# Altium project high-speed-thermocouple-logger.PrjPcb (part 3 of 3)

## Sheet mcu.SchDoc: tclogger
size A4; Date: 2024-05-30; CheckedBy: Boris Botev; DrawnBy: Iliyan Antov; Organization: Medical Technologies CZ a.s.; Revision: 100; SheetNumber: 9; SheetTotal: 10; Version1: N/A; Version2: N/A; Version3: N/A; Change1description: N/A; Change2description: N/A; Change3description: N/A; Change1DrawnBy: N/A; Change2DrawnBy: N/A; Change3DrawnBy: N/A; Change1CheckedBy: N/A; Change2CheckedBy: N/A; Change3CheckedBy: N/A; PreviusVersion_Chng1: N/A; PreviusVersion_Chng2: N/A; PreviusVersion_Chng3: N/A; Variant1description: Standard assembly; Variant2description: N/A; Variant3description: N/A; Variant4description: N/A; PrimaryCard1: XXXxxxXXX; PrimaryCard2: N/A; PrimaryCard3: N/A; PrimaryCard4: N/A; SPICEModelCacheGIGEAIGC: <root> / <DocumentId>GIGEAIGC</DocumentId> / <CacheFrame Number="0"> / <Model Name="grm188r72a104ka35" Kind="CKT"> / <Text>*---------------------------------------------------------------------- / * SPICE Model generated by Murata Manufacturing Co., Ltd. / * Copyright(C) Murata Manufacturing Co., Ltd. / * Description :1608M(0603)/X7R/0.1uF/100V / * Murata P/N :GRM188R72A104KA35 / * Property : C = 0.1[uF] / *---------------------------------------------------------------------- / * Applicable Conditions: / *   Frequency Range = 100Hz-6GHz / *   Temperature = 25 degC / *   DC Bias Voltage = 0V / *   Small Signal Operation / *---------------------------------------------------------------------- / .SUBCKT GRM188R72A104KA35 port1 port2 / C1 port1 11 9.94e-8 / L2 11 12 1.68e-10 / R3 12 13 1.35e-2 / C4 13 14 1.39e-5 / R4 13 14 285 / C5 14 15 2.35e-5 / R5 14 15 28.5 / C6 15 16 1.88e-5 / R6 15 16 7.00 / C7 16 17 1.68e-5 / R7 16 17 9.47e-1 / C8 17 18 1.50e-5 / R8 17 18 1.51e-1 / C9 18 19 1.07e-5 / R9 18 19 2.98e-2 / C10 19 20 1.31e-5 / R10 19 20 3.83e-3 / L11 20 21 1.43e-11 / R11 20 21 8.15e-2 / L12 21 22 1.08e-10 / R12 21 22 7.26e-2 / C13 22 23 4.76e-7 / L13 22 23 2.94e-11 / R13 22 23 3.05e-2 / C14 23 24 1.58e-7 / L14 23 24 2.63e-11 / R14 23 24 2.63e-2 / C15 24 port2 3.33e-12 / L15 24 port2 1.14e-10 / R15 24 port2 22.5 / R100 port1 11 5.00e+9 / .ENDS GRM188R72A104KA35</Text> / </Model> / <Model Name="c1608x5r1e475m080ac_p" Kind="CKT"> / <Text>*---------------------------------------------------------------------- / * SPICE Netlist Generated by TDK Corporation / * Copyright(C) 2015 TDK Corporation. / * All Rights Reserved. / *---------------------------------------------------------------------- / * TDK P/N: C1608X5R1E475M080AC (Multilayer Ceramic Chip Capacitor) / * Property: C=4.7uF / * Size(LxWxT): 1.6x0.8x0.8mm, 0.063x0.031x0.031inches / * Model Type: Precise Model / * Model Generated on June 29, 2015 / *---------------------------------------------------------------------- / * Terms and conditions regarding TDK Simulation Models: / * 1)This simulation model is being provided solely for informational / *   purposes. Please refer to the specifications of the products in / *   terms of detailed characteristics of such products. / * 2)In no event shall TDK Corporation of any of its subsidiaries be / *   liable for any loss or damage arising, directly or indirectly, / *   from any information contained in this simulation model, including, / *   but not limited to loss or damages arising from any inaccuracies, / *   omissions or errors in connection with such information. / * 3)Any and all copyrights on this simulation model are owned by / *   TDK Corporation.  Duplication or redistribution of this simulation / *   model without prior written permission from TDK Corporation / *   is prohibited. / * 4)This simulation model is subject to any modification or change / *   without any prior notice. / * 5)Neither TDK Corporation nor any of its subsidiaries shall make any / *   warranty, express or implied, including but not limited to the / *   correctness, implied warranties of merchantability and fitness for / *   a particular purpose with respect to this simulation models. / * 6)The use of this simulation model shall be deemed to have consented / *   to the terms and conditions hereof. / *---------------------------------------------------------------------- / * External Node Assignments: / * / *  n1 ---| |--- n2 / * / *---------------------------------------------------------------------- / * Applicable Conditions: / *   Temperature = 25 degC / *   DC Bias Voltage = 0 V / *   Small Signal Operation / *---------------------------------------------------------------------- / .SUBCKT C1608X5R1E475M080AC_p n1 n2 / C1 n1 11 4.06623047E-06 / C2 n1 12 1.69290768E-07 / C3 n1 13 1.69290768E-07 / C4 n1 14 1.69290768E-07 / C5 n1 15 1.69290768E-07 / C6 n1 16 1.69290768E-07 / C7 n1 17 1.69290768E-07 / L1 n2 21 4.20000000E-10 / R1 11 21 3.80511499E-03 / R2 11 12 2.03392838E+00 / R3 11 13 1.38719873E+01 / R4 11 14 9.43354501E+01 / R5 11 15 6.39787773E+02 / R6 11 16 4.32816378E+03 / R7 11 17 2.92113653E+04 / R8 n1 11 2.10000000E+07 / .ENDS C1608X5R1E475M080AC_p</Text> / </Model> / <Model Name="mmz2012y152bt000_s" Kind="CKT"> / <Text>*---------------------------------------------------------------------- / * SPICE Netlist Generated by TDK Corporation / * Copyright(C) 2015 TDK Corporation. / * All Rights Reserved. / *---------------------------------------------------------------------- / * TDK P/N: MMZ2012Y152BT000 (Chip Bead) / * Property: |Z|=1500ohm at 100MHz / * Size(LxWxT): 2x1.25x0.85mm, 0.079x0.049x0.033inches / * Model Type: Simple Model / * Model Generated on June 29, 2015 / *---------------------------------------------------------------------- / * Terms and conditions regarding TDK Simulation Models: / * 1)This simulation model is being provided solely for informational / *   purposes. Please refer to the specifications of the products in / *   terms of detailed characteristics of such products. / * 2)In no event shall TDK Corporation of any of its subsidiaries be / *   liable for any loss or damage arising, directly or indirectly, / *   from any information contained in this simulation model, including, / *   but not limited to loss or damages arising from any inaccuracies, / *   omissions or errors in connection with such information. / * 3)Any and all copyrights on this simulation model are owned by / *   TDK Corporation.  Duplication or redistribution of this simulation / *   model without prior written permission from TDK Corporation / *   is prohibited. / * 4)This simulation model is subject to any modification or change / *   without any prior notice. / * 5)Neither TDK Corporation nor any of its subsidiaries shall make any / *   warranty, express or implied, including but not limited to the / *   correctness, implied warranties of merchantability and fitness for / *   a particular purpose with respect to this simulation models. / * 6)The use of this simulation model shall be deemed to have consented / *   to the terms and conditions hereof. / *---------------------------------------------------------------------- / * External Node Assignments: / * / *  n1 ---@@@--- n2 / * / *---------------------------------------------------------------------- / * Applicable Conditions: / *   Temperature = 25 degC / *   DC Bias Current = 0 A / *   Small Signal Operation / *---------------------------------------------------------------------- / .SUBCKT MMZ2012Y152BT000_s n1 n2 / C1 n1 11 6.60000000E-13 / L1 n1 11 2.70000000E-06 / R1 n1 11 1.60000000E+03 / R2 n2 11 2.50000000E-01 / .ENDS MMZ2012Y152BT000_s</Text> / </Model> / <Model Name="mmz1608b301ctah0_s" Kind="CKT"> / <Text>*---------------------------------------------------------------------- / * SPICE Netlist Generated by TDK Corporation / * Copyright(C) 2015 TDK Corporation. / * All Rights Reserved. / *---------------------------------------------------------------------- / * TDK P/N: MMZ1608B301CTAH0 (Chip Bead) / * Property: |Z|=300ohm at 100MHz / * Size(LxWxT): 1.6x0.8x0.6mm, 0.063x0.031x0.024inches / * Model Type: Simple Model / * Model Generated on June 29, 2015 / *---------------------------------------------------------------------- / * Terms and conditions regarding TDK Simulation Models: / * 1)This simulation model is being provided solely for informational / *   purposes. Please refer to the specifications of the products in / *   terms of detailed characteristics of such products. / * 2)In no event shall TDK Corporation of any of its subsidiaries be / *   liable for any loss or damage arising, directly or indirectly, / *   from any information contained in this simulation model, including, / *   but not limited to loss or damages arising from any inaccuracies, / *   omissions or errors in connection with such information. / * 3)Any and all copyrights on this simulation model are owned by / *   TDK Corporation.  Duplication or redistribution of this simulation / *   model without prior written permission from TDK Corporation / *   is prohibited. / * 4)This simulation model is subject to any modification or change / *   without any prior notice. / * 5)Neither TDK Corporation nor any of its subsidiaries shall make any / *   warranty, express or implied, including but not limited to the / *   correctness, implied warranties of merchantability and fitness for / *   a particular purpose with respect to this simulation models. / * 6)The use of this simulation model shall be deemed to have consented / *   to the terms and conditions hereof. / *---------------------------------------------------------------------- / * External Node Assignments: / * / *  n1 ---@@@--- n2 / * / *---------------------------------------------------------------------- / * Applicable Conditions: / *   Temperature = 25 degC / *   DC Bias Current = 0 A / *   Small Signal Operation / *---------------------------------------------------------------------- / .SUBCKT MMZ1608B301CTAH0_s n1 n2 / C1 n1 11 3.00000000E-13 / L1 n1 11 5.30000000E-06 / R1 n1 11 3.00000000E+02 / R2 n2 11 1.50000000E-01 / .ENDS MMZ1608B301CTAH0_s</Text> / </Model> / <Model Name="grt188r61h105ke13" Kind="CKT"> / <Text>*---------------------------------------------------------------------- / * SPICE Model generated by Murata Manufacturing Co., Ltd. / * Copyright(C) Murata Manufacturing Co., Ltd. / * Description :1608M(0603)/X5R/1uF/50V / * Murata P/N :GRT188R61H105KE13 / * Property : C = 1[uF] / *---------------------------------------------------------------------- / * Applicable Conditions: / *   Frequency Range = 100Hz-6GHz / *   Temperature = 25 degC / *   DC Bias Voltage = 5V / *   Small Signal Operation / *---------------------------------------------------------------------- / .SUBCKT GRT188R61H105KE13 port1 port2 / C1 port1 11 7.62e-7 / L2 11 12 1.16e-10 / R3 12 13 7.65e-3 / C4 13 14 3.94e-6 / R4 13 14 1.77e+3 / C5 14 15 1.75e-5 / R5 14 15 15.4 / C6 15 16 1.51e-5 / R6 15 16 1.76 / C7 16 17 1.17e-5 / R7 16 17 2.01e-1 / C8 17 18 8.13e-6 / R8 17 18 2.61e-2 / L9 18 19 2.29e-11 / R9 18 19 8.12e-2 / L10 19 20 1.53e-10 / R10 19 20 4.15e-2 / C11 20 21 2.62e-6 / L11 20 21 3.15e-11 / R11 20 21 1.12e-2 / C12 21 22 7.84e-7 / L12 21 22 5.54e-11 / R12 21 22 1.32e-2 / C13 22 port2 1.55e-12 / L13 22 port2 1.73e-10 / R13 22 port2 64.4 / R100 port1 11 5.00e+7 / .ENDS GRT188R61H105KE13</Text> / </Model> / <Model Name="c1608c0g1h103j080aa_p" Kind="CKT"> / <Text>*---------------------------------------------------------------------- / * SPICE Netlist Generated by TDK Corporation / * Copyright(C) 2015 TDK Corporation. / * All Rights Reserved. / *---------------------------------------------------------------------- / * TDK P/N: C1608C0G1H103J080AA (Multilayer Ceramic Chip Capacitor) / * Property: C=10nF / * Size(LxWxT): 1.6x0.8x0.8mm, 0.063x0.031x0.031inches / * Model Type: Precise Model / * Model Generated on June 29, 2015 / *---------------------------------------------------------------------- / * Terms and conditions regarding TDK Simulation Models: / * 1)This simulation model is being provided solely for informational / *   purposes. Please refer to the specifications of the products in / *   terms of detailed characteristics of such products. / * 2)In no event shall TDK Corporation of any of its subsidiaries be / *   liable for any loss or damage arising, directly or indirectly, / *   from any information contained in this simulation model, including, / *   but not limited to loss or damages arising from any inaccuracies, / *   omissions or errors in connection with such information. / * 3)Any and all copyrights on this simulation model are owned by / *   TDK Corporation.  Duplication or redistribution of this simulation / *   model without prior written permission from TDK Corporation / *   is prohibited. / * 4)This simulation model is subject to any modification or change / *   without any prior notice. / * 5)Neither TDK Corporation nor any of its subsidiaries shall make any / *   warranty, express or implied, including but not limited to the / *   correctness, implied warranties of merchantability and fitness for / *   a particular purpose with respect to this simulation models. / * 6)The use of this simulation model shall be deemed to have consented / *   to the terms and conditions hereof. / *---------------------------------------------------------------------- / * External Node Assignments: / * / *  n1 ---| |--- n2 / * / *---------------------------------------------------------------------- / * Applicable Conditions: / *   Temperature = 25 degC / *   DC Bias Voltage = 0 V / *   Small Signal Operation / *---------------------------------------------------------------------- / .SUBCKT C1608C0G1H103J080AA_p n1 n2 / C1 n1 11 1.00000000E-08 / L1 11 12 3.87447524E-10 / L2 12 13 3.02537762E-11 / L3 13 14 6.87230213E-11 / L4 14 15 1.66916342E-10 / L5 15 16 4.94708926E-10 / R1 n2 12 7.79169483E-02 / R2 n2 13 3.60336449E-02 / R3 n2 14 1.66641994E-02 / R4 n2 15 7.70656268E-03 / R5 n2 16 3.56399409E-03 / R6 n1 11 1.00000000E+10 / .ENDS C1608C0G1H103J080AA_p</Text> / </Model> / </CacheFrame> / </root>; DocumentName: Docname
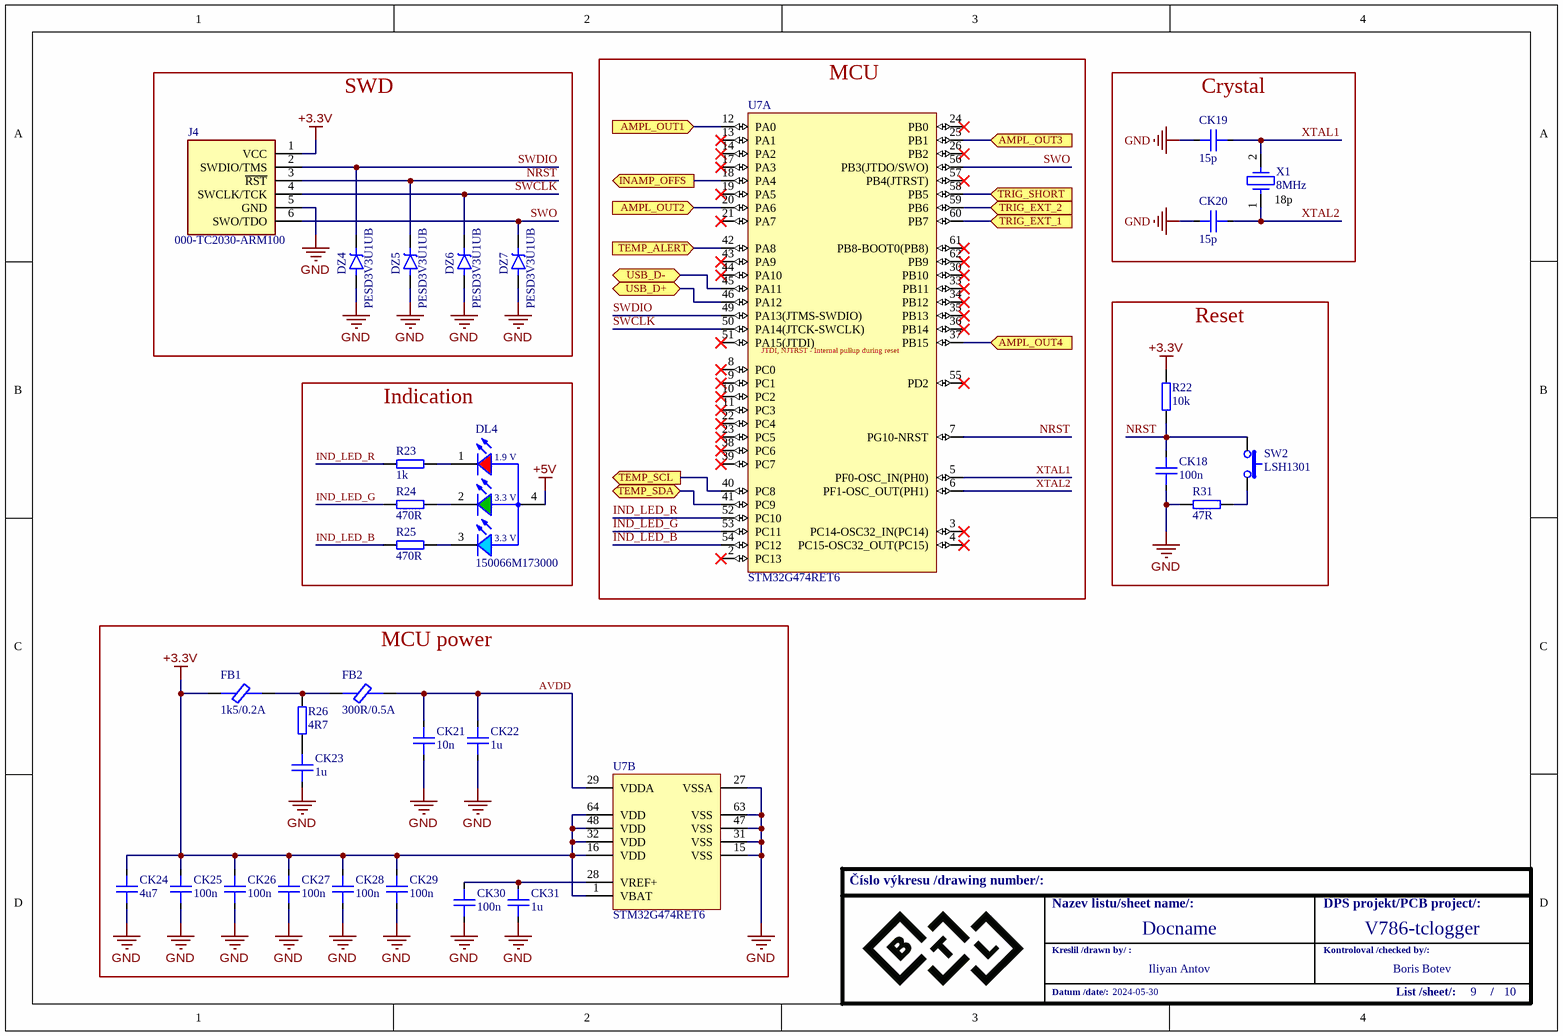
[diagram p8: mcu.SchDoc]

### Parts
CK18  100n  [CAPC1608X09N(SMC0603)]
CK19  15p  [CAPC1608X09N(SMC0603)]
CK20  15p  [CAPC1608X09N(SMC0603)]
CK21  10n  [CAPC1608X09N(SMC0603)]
CK22  1u  [CAPC1608X09N(SMC0603)]
CK23  1u  [CAPC1608X09N(SMC0603)]
CK24  4u7  [CAPC1608X09N(SMC0603)]
CK25  100n  [CAPC1608X09N(SMC0603)]
CK26  100n  [CAPC1608X09N(SMC0603)]
CK27  100n  [CAPC1608X09N(SMC0603)]
CK28  100n  [CAPC1608X09N(SMC0603)]
CK29  100n  [CAPC1608X09N(SMC0603)]
CK30  100n  [CAPC1608X09N(SMC0603)]
CK31  1u  [CAPC1608X09N(SMC0603)]
DL4  150066M173000  [WE_150066M173000]
DZ4  PESD3V3U1UB  [SODFL160X65-2N(SC79)]
DZ5  PESD3V3U1UB  [SODFL160X65-2N(SC79)]
DZ6  PESD3V3U1UB  [SODFL160X65-2N(SC79)]
DZ7  PESD3V3U1UB  [SODFL160X65-2N(SC79)]
FB1  1k5/0.2A  [INDC2012X08N(SML0805)]
FB2  300R/0.5A  [MMZ1608]
J4  000-TC2030-ARM100  [TC2030-MCP-NL]  (no BOM)
R22  10k  [RESC2012X06N(SMR0805)]
R23  1k  [RESC2012X06N(SMR0805)]
R24  470R  [RESC1608X06N(SMR0603)]
R25  470R  [RESC1608X06N(SMR0603)]
R26  4R7  [RESC2012X06N(SMR0805)]
R31  47R  [RESC2012X06N(SMR0805)]
SW2  LSH1301  [LSH_SWITCH]
U7  STM32G474RET6  [TSQFP50P1200X1200X160-64M]  (parts A,B of 2)
X1  8MHz  [TXC_7A]

### Blocks framed on the sheet
SWD: DZ4-DZ7 J4
MCU: U7
Crystal: CK19 CK20 X1
Reset: CK18 R22 R31 SW2
Indication: DL4 R23-R25
MCU power: CK21-CK31 FB1 FB2 R26 U7

### Ports
AMPL_OUT1 (in), AMPL_OUT2 (in), AMPL_OUT3 (in), AMPL_OUT4 (in), INAMP_OFFS (out), TEMP_ALERT (in), TEMP_SCL (out), TEMP_SDA (bidir), TRIG_EXT_1 (in), TRIG_EXT_2 (in), TRIG_SHORT (in), USB_D+ (bidir), USB_D- (bidir)

### Nets
+3.3V: CK24.2 CK25.2 CK26.2 CK27.2 CK28.2 CK29.2 FB1.1(L1A) J4.1(VCC) R22.2 U7.1(VBAT) U7.16(VDD) U7.32(VDD) U7.48(VDD) U7.64(VDD)
+5V: DL4.4(A)
GND: CK18.1 CK19.2 CK20.2 CK21.1 CK22.2 CK23.2 CK24.1 CK25.1 CK26.1 CK27.1 CK28.1 CK29.1 CK30.1 CK31.2 DZ4.2(A) DZ5.2(A) DZ6.2(A) DZ7.2(A) J4.5(GND) R31.2 U7.15(VSS) U7.27(VSSA) U7.31(VSS) U7.47(VSS) U7.63(VSS)
AMPL_OUT1: U7.12(PA0) ; port AMPL_OUT1
AMPL_OUT2: U7.20(PA6) ; port AMPL_OUT2
AMPL_OUT3: U7.25(PB1) ; port AMPL_OUT3
AMPL_OUT4: U7.37(PB15) ; port AMPL_OUT4
AVDD: CK21.2 CK22.1 FB2.2(L1B) U7.29(VDDA)
INAMP_OFFS: U7.18(PA4) ; port INAMP_OFFS
IND_LED_B: R25.1 U7.54(PC12)
IND_LED_G: R24.1 U7.53(PC11)
IND_LED_R: R23.2 U7.52(PC10)
NRST: CK18.2 DZ5.1(C) J4.3(~{RST}) R22.1 SW2.1 U7.7(PG10-NRST)
SWCLK: DZ6.1(C) J4.4(SWCLK/TCK) U7.50(PA14(JTCK-SWCLK))
SWDIO: DZ4.1(C) J4.2(SWDIO/TMS) U7.49(PA13(JTMS-SWDIO))
SWO: DZ7.1(C) J4.6(SWO/TDO) U7.56(PB3(JTDO/SWO))
TEMP_ALERT: U7.42(PA8) ; port TEMP_ALERT
TEMP_SCL: U7.40(PC8) ; port TEMP_SCL
TEMP_SDA: U7.41(PC9) ; port TEMP_SDA
USB_D_N: U7.45(PA11) ; port USB_D-
USB_D_P: U7.46(PA12) ; port USB_D+
XTAL1: CK19.1 U7.5(PF0-OSC_IN(PH0)) X1.2
XTAL2: CK20.1 U7.6(PF1-OSC_OUT(PH1)) X1.1
NetCK23_1: CK23.1 R26.1
NetCK30_2: CK30.2 CK31.1 U7.28(VREF+)
NetCK41_1: U7.58(PB5) ; port TRIG_SHORT
NetDL4_1: DL4.1(K) R23.1
NetDL4_2: DL4.2(K) R24.2
NetDL4_3: DL4.3(K) R25.2
NetFB1_2: FB1.2(L1B) FB2.1(L1A) R26.2
NetR29_2: U7.60(PB7) ; port TRIG_EXT_1
NetR30_2: U7.59(PB6) ; port TRIG_EXT_2
NetR31_1: R31.1 SW2.3

Not connected (* = marked no-connect by the designer): U7 2(PC13)* 3(PC14-OSC32_IN(PC14))* 4(PC15-OSC32_OUT(PC15))* 8(PC0)* 9(PC1)* 10(PC2)* 11(PC3)* 13(PA1)* 14(PA2)* 17(PA3)* 19(PA5)* 21(PA7)* 22(PC4)* 23(PC5)* 24(PB0)* 26(PB2)* 30(PB10)* 33(PB11)* 34(PB12)* 35(PB13)* 36(PB14)* 38(PC6)* 39(PC7)* 43(PA9)* 44(PA10)* 51(PA15(JTDI))* 55(PD2)* 57(PB4(JTRST))* 61(PB8-BOOT0(PB8))* 62(PB9)*

### Notes on the sheet
- (near X1) 18p
- Číslo výkresu /drawing number/:
- Nazev listu/sheet name/:
- DPS projekt/PCB project/:
- Kreslil /drawn by/ :
- Kontroloval /checked by/:
- Datum /date/:
- List /sheet/:
- /
- (in symbol EDL+150066M173000X00) 1.9 V; 3.3 V
- (in symbol STM32G474RET6, part A) JTDI, NJTRST - Internal pullup during reset

### Library data of the parts
CK18 CK25-CK30 = ECK+100N100VXX0: C; 100n; 100V; 10%; X7R; ??;; Manufacturer: Murata Electronics: GRM188R72A104KA35D;;Yageo: CC0603KRX7R0BB104; Component_Class: Capacitor; Status_I: Production; Status_II: Active; Tolerance_Pct: 10; Voltage_Rating_V: 100; Capacitance_F: 1E-7; KK: ECK+100N100VXX0; Value: 100n; SMD: 1; ComponentLink2URL: I:\DataSheets\ECK+100N100VXX0_MurataEN100.pdf; ComponentLink2Description: ECK+100N100VXX0_MurataEN100.pdf; ComponentLink3URL: I:\DataSheets\ECK+100N100VXX0_YageoEN100.pdf; ComponentLink3Description: ECK+100N100VXX0_YageoEN100.pdf; ComponentLink4URL: i:\DataSheets\ECK+100N100VXX0_2_MurataEN100.pdf; ComponentLink4Description: ECK+100N100VXX0_2_MurataEN100.pdf; ComponentLink5URL: i:\DataSheets\ECK+100N100VXX0_2_YageoEN100.pdf; ComponentLink5Description: ECK+100N100VXX0_2_YageoEN100.pdf; Dielectric_Type: X7R; ComponentLink1URL: heliosgreen://v1/hegMT/5-MT/Classes(343)/Folders/OpenForm?RecordNumbers=[10556034]; ComponentLink1Description: Helios
CK19 CK20 = ECK+15P25VXX0: C; 15p; 25V; 5%; NP0/C0G; ??;; Manufacturer: Samsung: CL10C150JB81PNC; Component_Class: Capacitor; Status_I: Production; Status_II: Active; Tolerance_Pct: 5; Voltage_Rating_V: 25; Capacitance_F: 1.5E-11; KK: ECK+15P25VXX0; Value: 15p; SMD: 1; ComponentLink2URL: I:\DataSheets\ECK+15P25VXX0_SamsungEN101.pdf; ComponentLink2Description: ECK+15P25VXX0_SamsungEN101.pdf; ComponentLink3URL: i:\DataSheets\ECK+15P25VXX0_2_SamsungEN101.pdf; ComponentLink3Description: ECK+15P25VXX0_2_SamsungEN101.pdf; Dielectric_Type: NP0/C0G; ComponentLink1URL: heliosgreen://v1/hegMT/5-MT/Classes(343)/Folders/OpenForm?RecordNumbers=[10889343]; ComponentLink1Description: Helios
CK21 = ECK+10N50V0603XX0: C; 10n; 50V; 5%; NP0/C0G; ??;; Manufacturer: TDK: C1608C0G1H103J080AA; Component_Class: Capacitor; Status_I: Production; Status_II: Do not order. Upon confirmation.; Tolerance_Pct: 5; Voltage_Rating_V: 50; Capacitance_F: 1E-8; KK: ECK+10N50V0603XX0; Value: 10n; SMD: 1; ComponentLink2URL: I:\DataSheets\ECK+10N50V0603XX0_TdkEN100.pdf; ComponentLink2Description: ECK+10N50V0603XX0_TdkEN100.pdf; Dielectric_Type: NP0/C0G; ComponentLink1URL: heliosgreen://v1/hegMT/5-MT/Classes(343)/Folders/OpenForm?RecordNumbers=[12587254]; ComponentLink1Description: Helios
CK22 CK23 CK31 = ECK+1U50VXX0: C; 1u; 50V; 10%; X5R; ??;; Manufacturer: TDK: C1608X5R1H105K080AB;;TDK: CGA3E3X5R1H105K080AB;;Murata: GRT188R61H105KE13D;;AVX: 06035D105KAT2A; Note: X5R: 0.52uF @ 10V, 0.2uF @ 25V (Murata); Component_Class: Capacitor; Status_I: Production; Status_II: Active; Tolerance_Pct: 10; Voltage_Rating_V: 50; Capacitance_F: 1E-6; KK: ECK+1U50VXX0; Value: 1u; SMD: 1; ComponentLink2URL: i:\DataSheets\ECK+1U50VXX0_TDKEN100.pdf; ComponentLink2Description: ECK+1U50VXX0_TDKEN100.pdf; ComponentLink3URL: I:\DataSheets\ECK+1U50VXX0_AVX_EN100.pdf; ComponentLink3Description: ECK+1U50VXX0_AVX_EN100.pdf; ComponentLink4URL: I:\DataSheets\ECK+1U50VXX0_MurataEN100.pdf; ComponentLink4Description: ECK+1U50VXX0_MurataEN100.pdf; ComponentLink5URL: I:\DataSheets\ECK+1U50VXX0_TDK_EN101.pdf; ComponentLink5Description: ECK+1U50VXX0_TDK_EN101.pdf; ComponentLink6URL: i:\DataSheets\ECK+1U50VXX0_2_AVX_EN100.pdf; ComponentLink6Description: ECK+1U50VXX0_2_AVX_EN100.pdf; Dielectric_Type: X5R; ComponentLink1URL: heliosgreen://v1/hegMT/5-MT/Classes(343)/Folders/OpenForm?RecordNumbers=[9390428]; ComponentLink1Description: Helios
CK24 = ECK+4U725VXX0: C; 4u7; 25V; 20%; X5R; ??;; Manufacturer: TDK Corporation: C1608X5R1E475M080AC; Note: X5R, 1.2uF @ 10V, 2.6uF @ 5V, 3.6uF @ 3.3V; Component_Class: Capacitor; Status_I: Production; Status_II: Active; Tolerance_Pct: 20; Voltage_Rating_V: 25; Capacitance_F: 4.7E-6; KK: ECK+4U725VXX0; Value: 4u7; SMD: 1; ComponentLink2URL: I:\DataSheets\ECK+4U725VXX0_TDK CorporationEN100.pdf; ComponentLink2Description: ECK+4U725VXX0_TDK CorporationEN100.pdf; Dielectric_Type: X5R; ComponentLink1URL: heliosgreen://v1/hegMT/5-MT/Classes(343)/Folders/OpenForm?RecordNumbers=[8599163]; ComponentLink1Description: Helios
DL4 = EDL+150066M173000X00: Ind; Light; Red/Green/Blue;; Manufacturer: Würth: 150066M173000; Component_Class: Indicator; Status_I: Production; Status_II: Active; KK: EDL+150066M173000X00; Value: 150066M173000; SMD: 1; ComponentLink2URL: i:\DataSheets\EDL+150066M173000_WurthEN100.pdf; ComponentLink2Description: EDL+150066M173000_WurthEN100.pdf; Indicator_Type: Light; Indicator_Output: Red/Green/Blue; ComponentLink1URL: heliosgreen://v1/hegMT/5-MT/Classes(343)/Folders/OpenForm?RecordNumbers=[12710357]; ComponentLink1Description: Helios
DZ4-DZ7 = ED+PESD3V3U1UBXX0: CP; Voltage [V] - Unidirectional; 4.5; R:Yes; 1x;; Manufacturer: Nexperia: PESD3V3U1UB,115;;NXP: PESD3V3U1UB,115; Component_Class: Circuit Protection; Status_I: Production; Status_II: Active; Multiplicity: 1; Resettable: Yes; Trip_Threshold: 4.5; KK: ED+PESD3V3U1UBXX0; Value: PESD3V3U1UB; SMD: 1; ComponentLink2URL: I:\DataSheets\ED+PESD3V3U1UBXX0_NexperiaEN100.pdf; ComponentLink2Description: ED+PESD3V3U1UBXX0_NexperiaEN100.pdf; Physical_Quantity: Voltage [V] - Unidirectional; ComponentLink1URL: heliosgreen://v1/hegMT/5-MT/Classes(343)/Folders/OpenForm?RecordNumbers=[10662650]; ComponentLink1Description: Helios
FB1 = EL+JCB09152XX0: Flt; Chip Bead; 0.7Ohm; 0.2A; ??V; 1x;; Manufacturer: COILMASTER: MB2012-152-LF;;JANTEK: JCB201209-152;;King Core: FBM-10-201209-102;;YAGEO: SBK2012T-152Y-S;;TDK: MMZ2012Y152B; Component_Class: Filter; Status_I: Production; Status_II: Active; Multiplicity: 1; Resistance_Ohm: 0.7; Current_Rating_A: 0.2; Mounting_Style: PCB; KK: EL+JCB09152XX0; Value: 1k5/0.2A; SMD: 1; ComponentLink2URL: i:\DataSheets\EL+JCB09152XX0_Coilmaster.pdf; ComponentLink2Description: EL+JCB09152XX0_Coilmaster.pdf; Filter_Type: Chip Bead; ComponentLink1URL: heliosgreen://v1/hegMT/5-MT/Classes(343)/Folders/OpenForm?RecordNumbers=[381245]; ComponentLink1Description: Helios
FB2 = EL+MMZ1608B301XX0: Flt; Chip Bead; 0.25Ohm; 0.5A; ??V; 1x;; Manufacturer: TDK: MMZ1608B301CTAH0;;TDK: MMZ1608B301CT; Component_Class: Filter; Status_I: Production; Status_II: Active; Multiplicity: 1; Resistance_Ohm: 0.25; Current_Rating_A: 0.5; Mounting_Style: PCB; KK: EL+MMZ1608B301XX0; Value: 300R/0.5A; SMD: 1; ComponentLink2URL: I:\DataSheets\EL+MMZ1608B301XX0_TDK EN100.pdf; ComponentLink2Description: EL+MMZ1608B301XX0_TDK EN100.pdf; Filter_Type: Chip Bead; ComponentLink1URL: heliosgreen://v1/hegMT/5-MT/Classes(343)/Folders/OpenForm?RecordNumbers=[10556082]; ComponentLink1Description: Helios
J4 = 000-TC2030-ARM100: De; Programming connector;; Note: Programming connector ARM - STM32; Component_Class: Design Entity; Status_I: Development; Status_II: Testing; KK: 000-TC2030-ARM100; Value: 000-TC2030-ARM100; SMD: 0; Entity_Type: Programming connector; ComponentLink1URL: heliosgreen://v1/hegMT/5-MT/Classes(343)/Folders/OpenForm?RecordNumbers=[12745287]; ComponentLink1Description: Helios
R22 = ER+10K0.1WXXF: as R19-R21 on sheet cjc; KK: ER+10K0.1WXXF; Value: 10k; SMD: 1; ComponentLink2URL: i:\DataSheets\ER+0.1WXXF_Yageo.pdf; ComponentLink2Description: ER+0.1WXXF_Yageo.pdf; Multiplicity: 1; Resistor_Type: Thick Film; ComponentLink1URL: heliosgreen://v1/hegMT/5-MT/Classes(343)/Folders/OpenForm?RecordNumbers=[381481]; ComponentLink1Description: Helios
R23 = ER+1K0.1WXXF: R; 1k; 0.125W; 1%; 150V; Thick Film; ±100ppm/K; 1x;; Manufacturer: VISHAY: CRCW0805 1001 100 1% RT1 BC;;AVX: CR21-1001F-T;;BC Components: MCU0805-50 1% P5 1k0;;YAGEO: RC0805FR-071KL;;PANASONIC: ERJ 6EN F 1001 V;;HaS Lanskroun: CMF0805 1k0 1% 100ppm/K;;ASJ: CR21-1001-FL; Component_Class: Resistor; Status_I: Production; Status_II: Active; Tolerance_Pct: 1; Voltage_Rating_V: 150; Resistance_Ohm: 1000; Power_Rating_W: 0.125; Temperature_Coefficient_PPMpK: ±100; KK: ER+1K0.1WXXF; Value: 1k; SMD: 1; ComponentLink2URL: i:\DataSheets\ER+0.1WXXF_Yageo.pdf; ComponentLink2Description: ER+0.1WXXF_Yageo.pdf; Multiplicity: 1; Resistor_Type: Thick Film; ComponentLink1URL: heliosgreen://v1/hegMT/5-MT/Classes(343)/Folders/OpenForm?RecordNumbers=[381513]; ComponentLink1Description: Helios
R24 R25 = ER+470R0.1WXX2: R; 470R; 0.1W; 1%; 75V; Thick Film; ±100ppm/K; 1x;; Manufacturer: Yageo: RC0603FR-07470RL;;Panasonic: ERJ3EKF4700V; Component_Class: Resistor; Status_I: Production; Status_II: Active; Tolerance_Pct: 1; Voltage_Rating_V: 75; Resistance_Ohm: 470; Power_Rating_W: 0.1; Temperature_Coefficient_PPMpK: ±100; KK: ER+470R0.1WXX2; Value: 470R; SMD: 1; ComponentLink2URL: I:\DataSheets\ER+470R0.1WXX2_YageoEN100.pdf; ComponentLink2Description: ER+470R0.1WXX2_YageoEN100.pdf; ComponentLink3URL: I:\datasheets\ER+470R0.1WXX2_PanasonicEN100.pdf; ComponentLink3Description: ER+470R0.1WXX2_PanasonicEN100.pdf; Multiplicity: 1; Resistor_Type: Thick Film; ComponentLink1URL: heliosgreen://v1/hegMT/5-MT/Classes(343)/Folders/OpenForm?RecordNumbers=[11656564]; ComponentLink1Description: Helios
R26 = ER+4R70.1WXXJ: R; 4R7; 0.125W; 5%; 150V; Thick Film; ±200ppm/K; 1x;; Manufacturer: YAGEO: RC0805FR-074R7L;;BC Components: MCU0805-50 1% P5 4R7; Component_Class: Resistor; Status_I: Production; Status_II: Active; Tolerance_Pct: 5; Multiplicity: 1; Voltage_Rating_V: 150; Resistance_Ohm: 4.7; Power_Rating_W: 0.125; Temperature_Coefficient_PPMpK: ±200; KK: ER+4R70.1WXXJ; Value: 4R7; SMD: 1; ComponentLink2URL: i:\DataSheets\ER+0.1WXXF_Yageo.pdf; ComponentLink2Description: ER+0.1WXXF_Yageo.pdf; ComponentLink3URL: i:\DataSheets\ER+1WXXJ_Yageo.pdf; ComponentLink3Description: ER+1WXXJ_Yageo.pdf; Resistor_Type: Thick Film; ComponentLink1URL: heliosgreen://v1/hegMT/5-MT/Classes(343)/Folders/OpenForm?RecordNumbers=[381599]; ComponentLink1Description: Helios
R31 = ER+47R0.1WXXF: R; 47R; 0.125W; 1%; 150V; Thick Film; ±100ppm/K; 1x;; KK: ER+47R0.1WXXF
SW2 = ESW+LSH1301XX0: MSw; SPST; PCB; 1x; DC:12V; DC:0.05A; AC:??V; AC:??A; CV:??V; Push-button;; Manufacturer: DIPTRONICS: DTSM-62N-V-T/R; Component_Class: Mechanical Switch; Status_I: Production; Status_II: Active; Multiplicity: 1; Current_Rating_DC_A: 0.05; Voltage_Rating_DC_V: 12; KK: ESW+LSH1301XX0; Value: LSH1301; SMD: 1; ComponentLink2URL: i:\DataSheets\ESW+LSH1301H7XX0_Schurter.pdf; ComponentLink2Description: ESW+LSH1301H7XX0_Schurter.pdf; ComponentLink3URL: i:\DataSheets\SMD_parts_pictures\ESW+LSH1301XX0-a.jpg; ComponentLink3Description: ESW+LSH1301XX0-a.jpg; ComponentLink4URL: i:\DataSheets\SMD_parts_pictures\ESW+LSH1301XX0-b.jpg; ComponentLink4Description: ESW+LSH1301XX0-b.jpg; ComponentLink5URL: i:\DataSheets\ESW+LSH1301XX0_DiptronicsEN100.pdf; ComponentLink5Description: ESW+LSH1301XX0_DiptronicsEN100; Mounting_Style: PCB; Switch_Configuration: SPST; Mechanical_Switch_Type: Push-button; ComponentLink1URL: heliosgreen://v1/hegMT/5-MT/Classes(343)/Folders/OpenForm?RecordNumbers=[382002]; ComponentLink1Description: Helios
U7 = STM32G474RET6: ARM Cortex-M4 32-bit MCU+FPU, 213 DMIPS, 512 kB Flash, 128 kB Internal RAM, 52 I/Os, 64-pin LQFP, -40 to 85 degC, Tray; Value: STM32G474RET6; ComponentLink1Description: Datasheet; ComponentLink1URL: https://www.st.com/resource/en/datasheet/stm32g474cb.pdf
X1 = EX+8.000MXX2: Oth; Crystal;; Manufacturer: Abracon: ABM3-8.000MHZ-D2Y-T; Note: 8MHz, freq tol. 20ppm, freq stab. 30ppm, 18pF; Component_Class: Other; Status_I: Production; Status_II: Active; KK: EX+8.000MXX2; Value: 8MHz; SMD: 1; ComponentLink2URL: I:\DataSheets\EX+8.000MXX2_AbraconEN100.pdf; ComponentLink2Description: EX+8.000MXX2_AbraconEN100.pdf; Others_Type: Crystal; ComponentLink1URL: heliosgreen://v1/hegMT/5-MT/Classes(343)/Folders/OpenForm?RecordNumbers=[17102653]; ComponentLink1Description: Helios

## Sheet external.SchDoc: tclogger
size A4; Date: 2024-05-30; CheckedBy: Boris Botev; DrawnBy: Iliyan Antov; Organization: Medical Technologies CZ a.s.; Revision: 100; SheetNumber: 10; SheetTotal: 10; Version1: N/A; Version2: N/A; Version3: N/A; Change1description: N/A; Change2description: N/A; Change3description: N/A; Change1DrawnBy: N/A; Change2DrawnBy: N/A; Change3DrawnBy: N/A; Change1CheckedBy: N/A; Change2CheckedBy: N/A; Change3CheckedBy: N/A; PreviusVersion_Chng1: N/A; PreviusVersion_Chng2: N/A; PreviusVersion_Chng3: N/A; Variant1description: Standard assembly; Variant2description: N/A; Variant3description: N/A; Variant4description: N/A; PrimaryCard1: XXXxxxXXX; PrimaryCard2: N/A; PrimaryCard3: N/A; PrimaryCard4: N/A; SPICEModelCacheCBAVRFGJ: <root> / <DocumentId>CBAVRFGJ</DocumentId> / <CacheFrame Number="0"> / <Model Name="cl10b104kb8nnn" Kind="CKT"> / <Text>* CL10B104KB8NNN Multilayer Ceramic Capacitor Spice Model / *----------------------------------------------------------------------------------------------- / * Model Generated by Samsung Electro-Mechanics / * Samsung Spice Model Version 4.0 / * Products : Multilayer Ceramic Capacitor(General) / *----------------------------------------------------------------------------------------------- / * Characteristics : / * / *     Nominal Capacitance = 100nF / *     Capacitance Tolerance = +/-10% / *     TCC = X7R(-55 ~ +125 Cels.) / *     Rated Voltage = 50Vdc / *     Size = 0603(unit:inch), 1608(unit:mm) / *     Length = 1.60 +/-0.10 mm / *     Width = 0.80 +/-0.10 mm / *     Thickness = 0.80 +/-0.10 mm / *     Measurement Temperature : 25Cels. / *     DC bias Value = 0V / *     Frequency : 100Hz ~ 6GHz / *----------------------------------------------------------------------------------------------- / * External Node Assignments : / * / *  1  o---||---o  2 / * / *----------------------------------------------------------------------------------------------- / .SUBCKT CL10B104KB8NNN 1 2 / C1 1 3 9.77779E-08 / C16 17 18 5.88581E-06 / C17 18 19 1.59883E-05 / C18 19 20 2.23415E-04 / C19 20 21 2.53303E-04 / C2 3 4 4.35730E-06 / C20 21 22 2.53303E-04 / C21 22 23 2.53303E-04 / C22 23 24 2.53303E-04 / C23 24 25 2.15084E-07 / C24 25 26 2.53303E-04 / C25 26 27 2.53303E-04 / C26 27 28 1.17756E-11 / C27 28 2 1.47146E-11 / C3 4 5 5.29040E-06 / C4 5 6 4.77639E-06 / C5 6 7 4.40289E-06 / C6 7 8 6.13401E-06 / C7 8 9 3.96026E-06 / C8 9 10 1.05023E-06 / R1 1 3 1.00000E+08 / R11 12 13 5.22090E-02 / R12 13 14 7.93644E-02 / R13 14 15 1.00000E-06 / R14 15 16 1.00000E-06 / R15 16 17 1.00000E-06 / R16 17 18 1.28418E-02 / R17 18 19 1.33549E-03 / R18 19 20 5.00746E-04 / R19 20 21 1.00000E-06 / R2 3 4 1.20052E+03 / R20 21 22 1.00000E-06 / R21 22 23 1.00000E-06 / R22 23 24 1.00000E-06 / R23 24 25 1.43830E-02 / R24 25 26 1.00000E-06 / R25 26 27 1.00000E-06 / R26 27 28 8.70334E+00 / R27 28 2 4.40128E+00 / R3 4 5 1.73528E+02 / R4 5 6 3.26179E+01 / R5 6 7 5.92116E+00 / R6 7 8 6.17312E-01 / R7 8 9 1.09178E-01 / R8 9 10 8.30916E-04 / R9 10 11 2.00906E-02 / L10 11 12 1.28321E-10 / L11 12 13 7.89377E-11 / L12 13 14 2.11392E-11 / L13 14 15 1.00000E-10 / L14 15 16 1.00000E-10 / L15 16 17 1.00000E-10 / L16 17 18 3.76696E-09 / L17 18 19 2.57357E-10 / L18 19 20 5.61226E-12 / L19 20 21 1.00000E-10 / L20 21 22 1.00000E-10 / L21 22 23 1.00000E-10 / L22 23 24 1.00000E-10 / L23 24 25 2.12983E-11 / L24 25 26 1.00000E-10 / L25 26 27 1.00000E-10 / L26 27 28 4.22009E-11 / L27 28 2 6.31025E-11 / .ENDS CL10B104KB8NNN</Text> / </Model> / </CacheFrame> / </root>; DocumentName: Docname
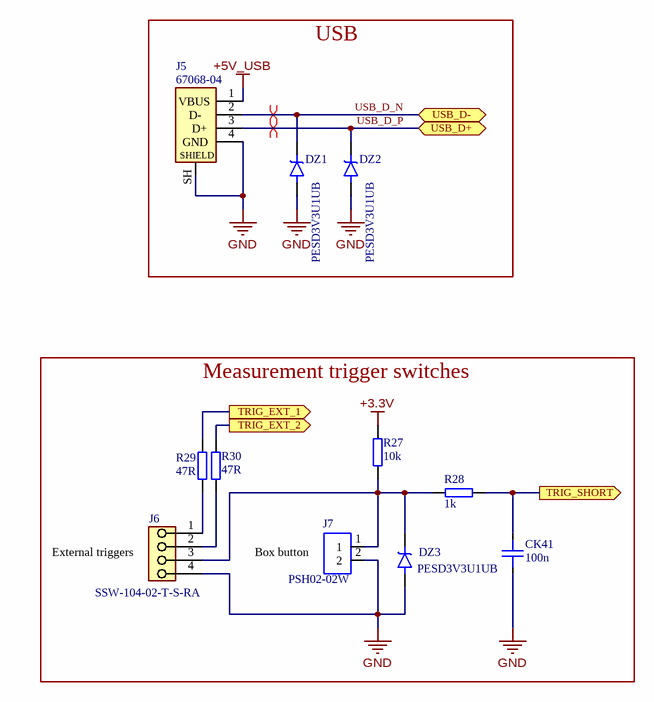
[diagram p9: external.SchDoc]

### Parts
CK41  100n  [CAPC1608X09N(SMC0603)]
DZ1  PESD3V3U1UB  [SODFL160X65-2N(SC79)]
DZ2  PESD3V3U1UB  [SODFL160X65-2N(SC79)]
DZ3  PESD3V3U1UB  [SODFL160X65-2N(SC79)]
J5  67068-04  [USB-B]
J6  SSW-104-02-T-S-RA  [SSW-104-02-T-S-RA]
J7  PSH02-02W  [Official_PSH0202W]
R27  10k  [RESC2012X06N(SMR0805)]
R28  1k  [RESC2012X06N(SMR0805)]
R29  47R  [RESC2012X06N(SMR0805)]
R30  47R  [RESC2012X06N(SMR0805)]

### Blocks framed on the sheet
USB: DZ1 DZ2 J5
Measurement trigger switches: CK41 DZ3 J6 J7 R27-R30

### Ports
TRIG_EXT_1 (out), TRIG_EXT_2 (out), TRIG_SHORT (out), USB_D+ (bidir), USB_D- (bidir)

### Nets
+3.3V: R27.2
+5V_USB: J5.1(VBUS)
GND: CK41.2 DZ1.2(A) DZ2.2(A) DZ3.2(A) J5.4(GND) J5.SH(SHIELD) J6.4 J7.2
USB_D_N: DZ1.1(C) J5.2(D-) ; port USB_D-
USB_D_P: DZ2.1(C) J5.3(D+) ; port USB_D+
NetCK41_1: CK41.1 R28.1 ; port TRIG_SHORT
NetDZ3_1: DZ3.1(C) J6.3 J7.1 R27.1 R28.2
NetJ6_1: J6.1 R29.1
NetJ6_2: J6.2 R30.1
NetR29_2: R29.2 ; port TRIG_EXT_1
NetR30_2: R30.2 ; port TRIG_EXT_2

### Layout directives
differential pair: USB_D_N, USB_D_P

### Notes on the sheet
- (near J6) External triggers
- (near J7) Box button
- Číslo výkresu /drawing number/:
- Nazev listu/sheet name/:
- DPS projekt/PCB project/:
- Kreslil /drawn by/ :
- Kontroloval /checked by/:
- Datum /date/:
- List /sheet/:
- /

### Library data of the parts
CK41 = ECK+100N50V0603XXK: C; 100n; 50V; 10%; X7R; ??;; Manufacturer: SAMSUNG EM: CL10B104KB8NNNC;;SAMSUNG EM: CL10B104KB8NNNO;;SAMSUNG EM: CL10B104KB8NNND; Component_Class: Capacitor; Status_I: Production; Status_II: Active; Tolerance_Pct: 10; Voltage_Rating_V: 50; Capacitance_F: 1E-7; KK: ECK+100N50V0603XXK; Value: 100n; SMD: 1; ComponentLink2URL: i:\datasheets\ECK+100N50V0603XXK_SamsungEN100.pdf; ComponentLink2Description: ECK+100N50V0603XXK_SamsungEN100.pdf; ComponentLink3URL: I:\datasheets\ECK+100N50V0603XXK_Samsung_2EN100.pdf.pdf; ComponentLink3Description: ECK+100N50V0603XXK_Samsung_2EN100.pdf.pd; Dielectric_Type: X7R; ComponentLink1URL: heliosgreen://v1/hegMT/5-MT/Classes(343)/Folders/OpenForm?RecordNumbers=[6094397]; ComponentLink1Description: Helios
DZ1-DZ3 = ED+PESD3V3U1UBXX0: as DZ4 on sheet mcu; KK: ED+PESD3V3U1UBXX0; Value: PESD3V3U1UB; SMD: 1; ComponentLink2URL: I:\DataSheets\ED+PESD3V3U1UBXX0_NexperiaEN100.pdf; ComponentLink2Description: ED+PESD3V3U1UBXX0_NexperiaEN100.pdf; Physical_Quantity: Voltage [V] - Unidirectional; ComponentLink1URL: heliosgreen://v1/hegMT/5-MT/Classes(343)/Folders/OpenForm?RecordNumbers=[10662650]; ComponentLink1Description: Helios
J5 = EJ-67068-04XX0: Con; USB; 1x; PCB; Right angle; 250V; 1.5A; Female; Gold; ??;; Manufacturer: HSUAN MAO: C8317-04BFHSB0R;;HSM: C8317-04BFHSB0R; Note: USB B; Component_Class: Connector; Status_I: Production; Status_II: Active; Multiplicity: 1; Voltage_Rating_V: 250; Current_Rating_A: 1.5; KK: EJ-67068-04XX0; Value: 67068-04; SMD: 0; ComponentLink2URL: i:\datasheets\EJ-67068-04XX0_Hsuan Mao.pdf; ComponentLink2Description: EJ-67068-04XX0_Hsuan Mao.pdf; Mounting_Style: PCB; Connector_Family: USB; Angle: Right angle; Gender: Female; Plating: Gold; ComponentLink1URL: heliosgreen://v1/hegMT/5-MT/Classes(343)/Folders/OpenForm?RecordNumbers=[380719]; ComponentLink1Description: Helios; System: Connector
J6 = SSW-104-02-T-S-RA: Female Header, Single row, 1 x 4, R/A, THT
J7 = EJ-PSH0202WXX0: Con; PFH/PSH; 2x; PCB; Right angle; 250V; 3A; Male; Tin; ??;; Manufacturer: Neltron: 2217R-XX-WH2; Component_Class: Connector; Status_I: Production; Status_II: Active; Multiplicity: 2; Voltage_Rating_V: 250; Current_Rating_A: 3; KK: EJ-PSH0202WXX0; Value: PSH02-02W; SMD: 0; ComponentLink2URL: I:\datasheets\EJ-PSH0202WXX0_NeltronEN100.pdf; ComponentLink2Description: EJ-PSH0202WXX0_NeltronEN100.pdf; Mounting_Style: PCB; Connector_Family: PFH/PSH; Angle: Right angle; Gender: Male; Plating: Tin; ComponentLink1URL: heliosgreen://v1/hegMT/5-MT/Classes(343)/Folders/OpenForm?RecordNumbers=[380843]; ComponentLink1Description: Helios; System: Connector
R27 = ER+10K0.1WXXF: as R19-R21 on sheet cjc; KK: ER+10K0.1WXXF; Value: 10k; SMD: 1; ComponentLink2URL: i:\DataSheets\ER+0.1WXXF_Yageo.pdf; ComponentLink2Description: ER+0.1WXXF_Yageo.pdf; Multiplicity: 1; Resistor_Type: Thick Film; ComponentLink1URL: heliosgreen://v1/hegMT/5-MT/Classes(343)/Folders/OpenForm?RecordNumbers=[381481]; ComponentLink1Description: Helios
R28 = ER+1K0.1WXXF: as R23 on sheet mcu; KK: ER+1K0.1WXXF; Value: 1k; SMD: 1; ComponentLink2URL: i:\DataSheets\ER+0.1WXXF_Yageo.pdf; ComponentLink2Description: ER+0.1WXXF_Yageo.pdf; Multiplicity: 1; Resistor_Type: Thick Film; ComponentLink1URL: heliosgreen://v1/hegMT/5-MT/Classes(343)/Folders/OpenForm?RecordNumbers=[381513]; ComponentLink1Description: Helios
R29 R30 = ER+47R0.1WXXF: as R31 on sheet mcu; KK: ER+47R0.1WXXF

## Nets that join several sheets
+3.3V: power (CK8.1 R3.2 TP6.1 U3.5), U_inamp1 (CK14A.1 DS5A.2 U5A.8), U_inamp2 (CK14B.1 DS5B.2 U5B.8), U_inamp3 (CK14C.1 DS5C.2 U5C.8), U_inamp4 (CK14D.1 DS5D.2 U5D.8), cjc (5 pins), mcu (14 pins), external (R27.2)
+5V: U_filter1 (R33A.2), U_filter2 (R33B.2), U_filter3 (R33C.2), U_filter4 (R33D.2), power (9 pins), U_inamp1 (CK13A.1 U4A.8), U_inamp2 (CK13B.1 U4B.8), U_inamp3 (CK13C.1 U4C.8), U_inamp4 (CK13D.1 U4D.8), mcu (DL4.4)
-5V: U_filter1 (R34A.1), U_filter2 (R34B.1), U_filter3 (R34C.1), U_filter4 (R34D.1), power (6 pins), U_inamp1 (CK15A.1 U4A.5), U_inamp2 (CK15B.1 U4B.5), U_inamp3 (CK15C.1 U4C.5), U_inamp4 (CK15D.1 U4D.5)
GND: U_filter1 (8 pins), U_filter2 (8 pins), U_filter3 (8 pins), U_filter4 (8 pins), power (21 pins), U_inamp1 (6 pins), U_inamp2 (6 pins), U_inamp3 (6 pins), U_inamp4 (6 pins), cjc (CK17.2 U6.6), mcu (25 pins), external (8 pins)
1MHZ_FILT_OUT+_U_filter1: U_filter1 (L2A.2 R8A.1 R13A.2 TP8A.1), U_filter1/UC2 (CK40A.2 CK41A.2 CVAR1A.2), U_filter1/UC4 (CK33B.1)
1MHZ_FILT_OUT+_U_filter2: U_filter2 (L2B.2 R8B.1 R13B.2 TP8B.1), U_filter2/UC2 (CK40C.2 CK41C.2 CVAR1C.2), U_filter2/UC4 (CK33D.1)
1MHZ_FILT_OUT+_U_filter3: U_filter3 (L2C.2 R8C.1 R13C.2 TP8C.1), U_filter3/UC2 (CK40E.2 CK41E.2 CVAR1E.2), U_filter3/UC4 (CK33F.1)
1MHZ_FILT_OUT+_U_filter4: U_filter4 (L2D.2 R8D.1 R13D.2 TP8D.1), U_filter4/UC2 (CK40G.2 CK41G.2 CVAR1G.2), U_filter4/UC4 (CK33H.1)
1MHZ_FILT_OUT-_U_filter1: U_filter1 (5 pins), U_filter1/UC3 (CK40B.2 CK41B.2 CVAR1B.2)
1MHZ_FILT_OUT-_U_filter2: U_filter2 (5 pins), U_filter2/UC3 (CK40D.2 CK41D.2 CVAR1D.2)
1MHZ_FILT_OUT-_U_filter3: U_filter3 (5 pins), U_filter3/UC3 (CK40F.2 CK41F.2 CVAR1F.2)
1MHZ_FILT_OUT-_U_filter4: U_filter4 (5 pins), U_filter4/UC3 (CK40H.2 CK41H.2 CVAR1H.2)
AMPL_OUT1: U_inamp1 (CK16A.1 R15A.1), mcu (U7.12)
AMPL_OUT2: U_inamp2 (CK16B.1 R15B.1), mcu (U7.20)
AMPL_OUT3: U_inamp3 (CK16C.1 R15C.1), mcu (U7.25)
AMPL_OUT4: U_inamp4 (CK16D.1 R15D.1), mcu (U7.37)
INAMP+1: U_filter1 (R5A.2 R8A.2), U_inamp1 (U4A.4)
INAMP+2: U_filter2 (R5B.2 R8B.2), U_inamp2 (U4B.4)
INAMP+3: U_filter3 (R5C.2 R8C.2), U_inamp3 (U4C.4)
INAMP+4: U_filter4 (R5D.2 R8D.2), U_inamp4 (U4D.4)
INAMP-1: U_filter1 (R6A.2 R9A.2), U_inamp1 (U4A.1)
INAMP-2: U_filter2 (R6B.2 R9B.2), U_inamp2 (U4B.1)
INAMP-3: U_filter3 (R6C.2 R9C.2), U_inamp3 (U4C.1)
INAMP-4: U_filter4 (R6D.2 R9D.2), U_inamp4 (U4D.1)
INAMP_OFFS: U_inamp1 (R32A.2), U_inamp2 (R32B.2), U_inamp3 (R32C.2), U_inamp4 (R32D.2), mcu (U7.18)
NetCK33A_1: U_filter1 (L2A.1 R10A.2), U_filter1/UC1 (CK33A.1), U_filter1/UC2 (CK38A.1 CK40A.1 CVAR1A.1)
NetCK33C_1: U_filter2 (L2B.1 R10B.2), U_filter2/UC1 (CK33C.1), U_filter2/UC2 (CK38C.1 CK40C.1 CVAR1C.1)
NetCK33E_1: U_filter3 (L2C.1 R10C.2), U_filter3/UC1 (CK33E.1), U_filter3/UC2 (CK38E.1 CK40E.1 CVAR1E.1)
NetCK33G_1: U_filter4 (L2D.1 R10D.2), U_filter4/UC1 (CK33G.1), U_filter4/UC2 (CK38G.1 CK40G.1 CVAR1G.1)
NetCK37A_2: U_filter1 (L4A.2), U_filter1/UC1 (CK37A.2)
NetCK37B_2: U_filter1 (L5A.1), U_filter1/UC4 (CK37B.2)
NetCK37C_2: U_filter2 (L4B.2), U_filter2/UC1 (CK37C.2)
NetCK37D_2: U_filter2 (L5B.1), U_filter2/UC4 (CK37D.2)
NetCK37E_2: U_filter3 (L4C.2), U_filter3/UC1 (CK37E.2)
NetCK37F_2: U_filter3 (L5C.1), U_filter3/UC4 (CK37F.2)
NetCK37G_2: U_filter4 (L4D.2), U_filter4/UC1 (CK37G.2)
NetCK37H_2: U_filter4 (L5D.1), U_filter4/UC4 (CK37H.2)
NetCK38B_1: U_filter1 (L3A.1 L4A.1 R11A.2), U_filter1/UC3 (CK38B.1 CK40B.1 CVAR1B.1)
NetCK38D_1: U_filter2 (L3B.1 L4B.1 R11B.2), U_filter2/UC3 (CK38D.1 CK40D.1 CVAR1D.1)
NetCK38F_1: U_filter3 (L3C.1 L4C.1 R11C.2), U_filter3/UC3 (CK38F.1 CK40F.1 CVAR1F.1)
NetCK38H_1: U_filter4 (L3D.1 L4D.1 R11D.2), U_filter4/UC3 (CK38H.1 CK40H.1 CVAR1H.1)
NetCK41_1: mcu (U7.58), external (CK41.1 R28.1)
NetR29_2: mcu (U7.60), external (R29.2)
NetR30_2: mcu (U7.59), external (R30.2)
TEMP_ALERT: cjc (R21.1 TP16.1 U6.3), mcu (U7.42)
TEMP_SCL: cjc (R20.1 TP14.1 U6.4), mcu (U7.40)
TEMP_SDA: cjc (R19.1 TP15.1 U6.2), mcu (U7.41)
USB_D_N: mcu (U7.45), external (DZ1.1 J5.2)
USB_D_P: mcu (U7.46), external (DZ2.1 J5.3)

## Assembly variants
tclogger: all parts fitted